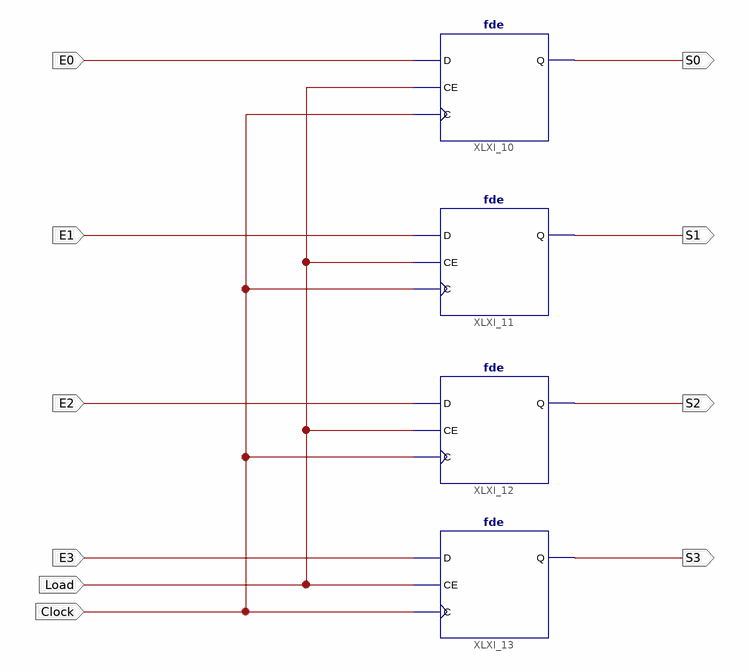
[diagram p0: schematic sheet 1]
// Xilinx ISE schematic Reg_A.sch (spartan3e) as structural Verilog: 4 symbols, 10 ports
module Reg_A (
  input  E3,
  input  E2,
  input  E1,
  input  E0,
  input  Clock,
  input  Load,
  output S0,
  output S2,
  output S3,
  output S1
);

  fde XLXI_10 (.C(Clock), .CE(Load), .D(E0), .Q(S0));
  fde XLXI_13 (.C(Clock), .CE(Load), .D(E3), .Q(S3));
  fde XLXI_12 (.C(Clock), .CE(Load), .D(E2), .Q(S2));
  fde XLXI_11 (.C(Clock), .CE(Load), .D(E1), .Q(S1));
endmodule
